# EAGLE board sboardnew (EAGLE 6.6.0)
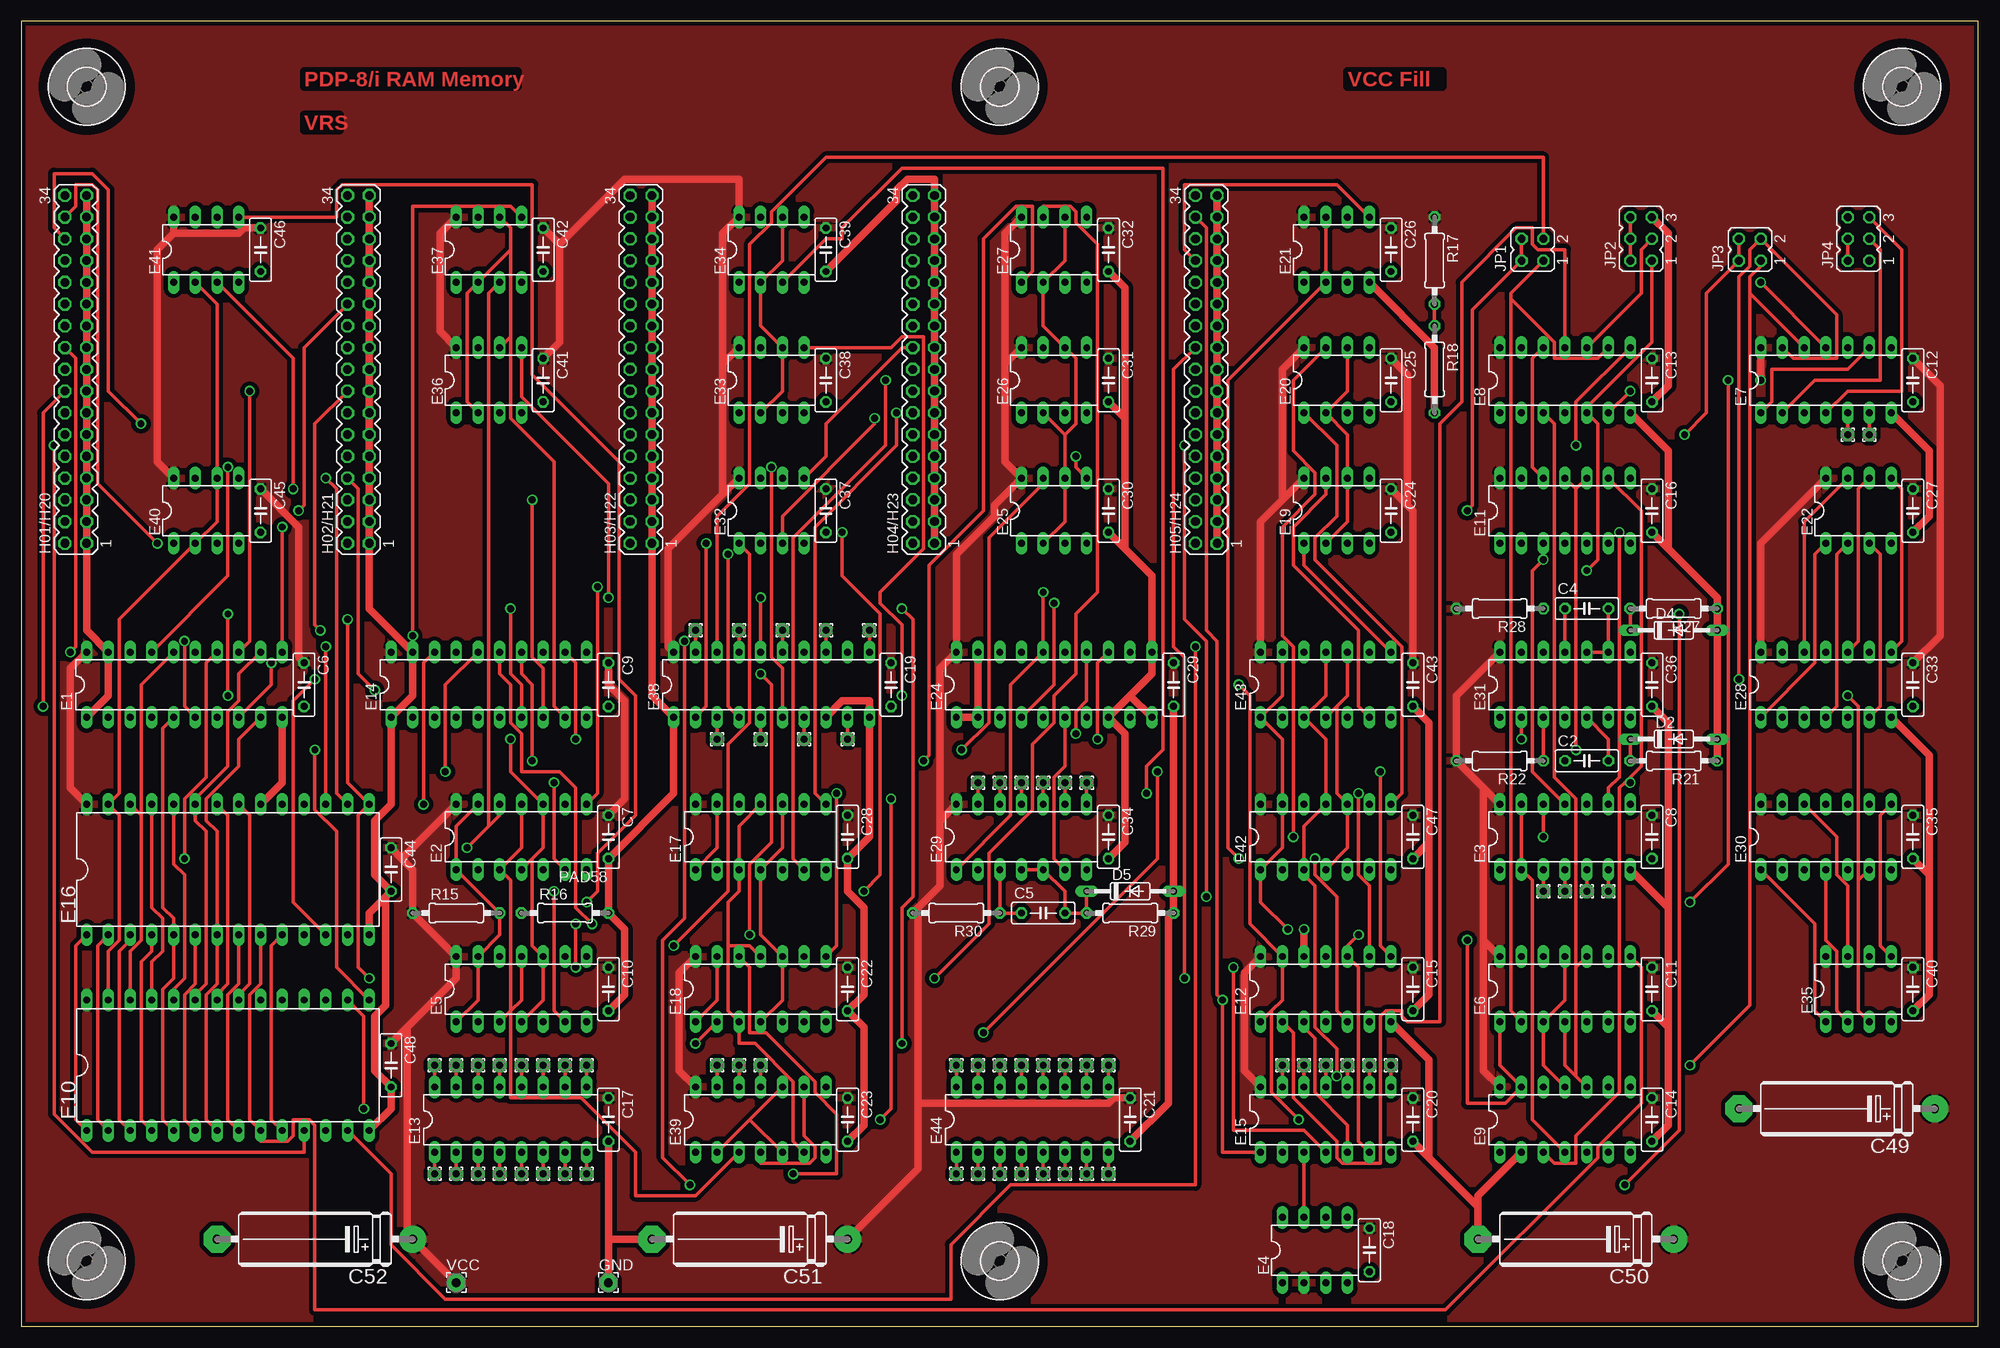
[diagram p5: board, top side]
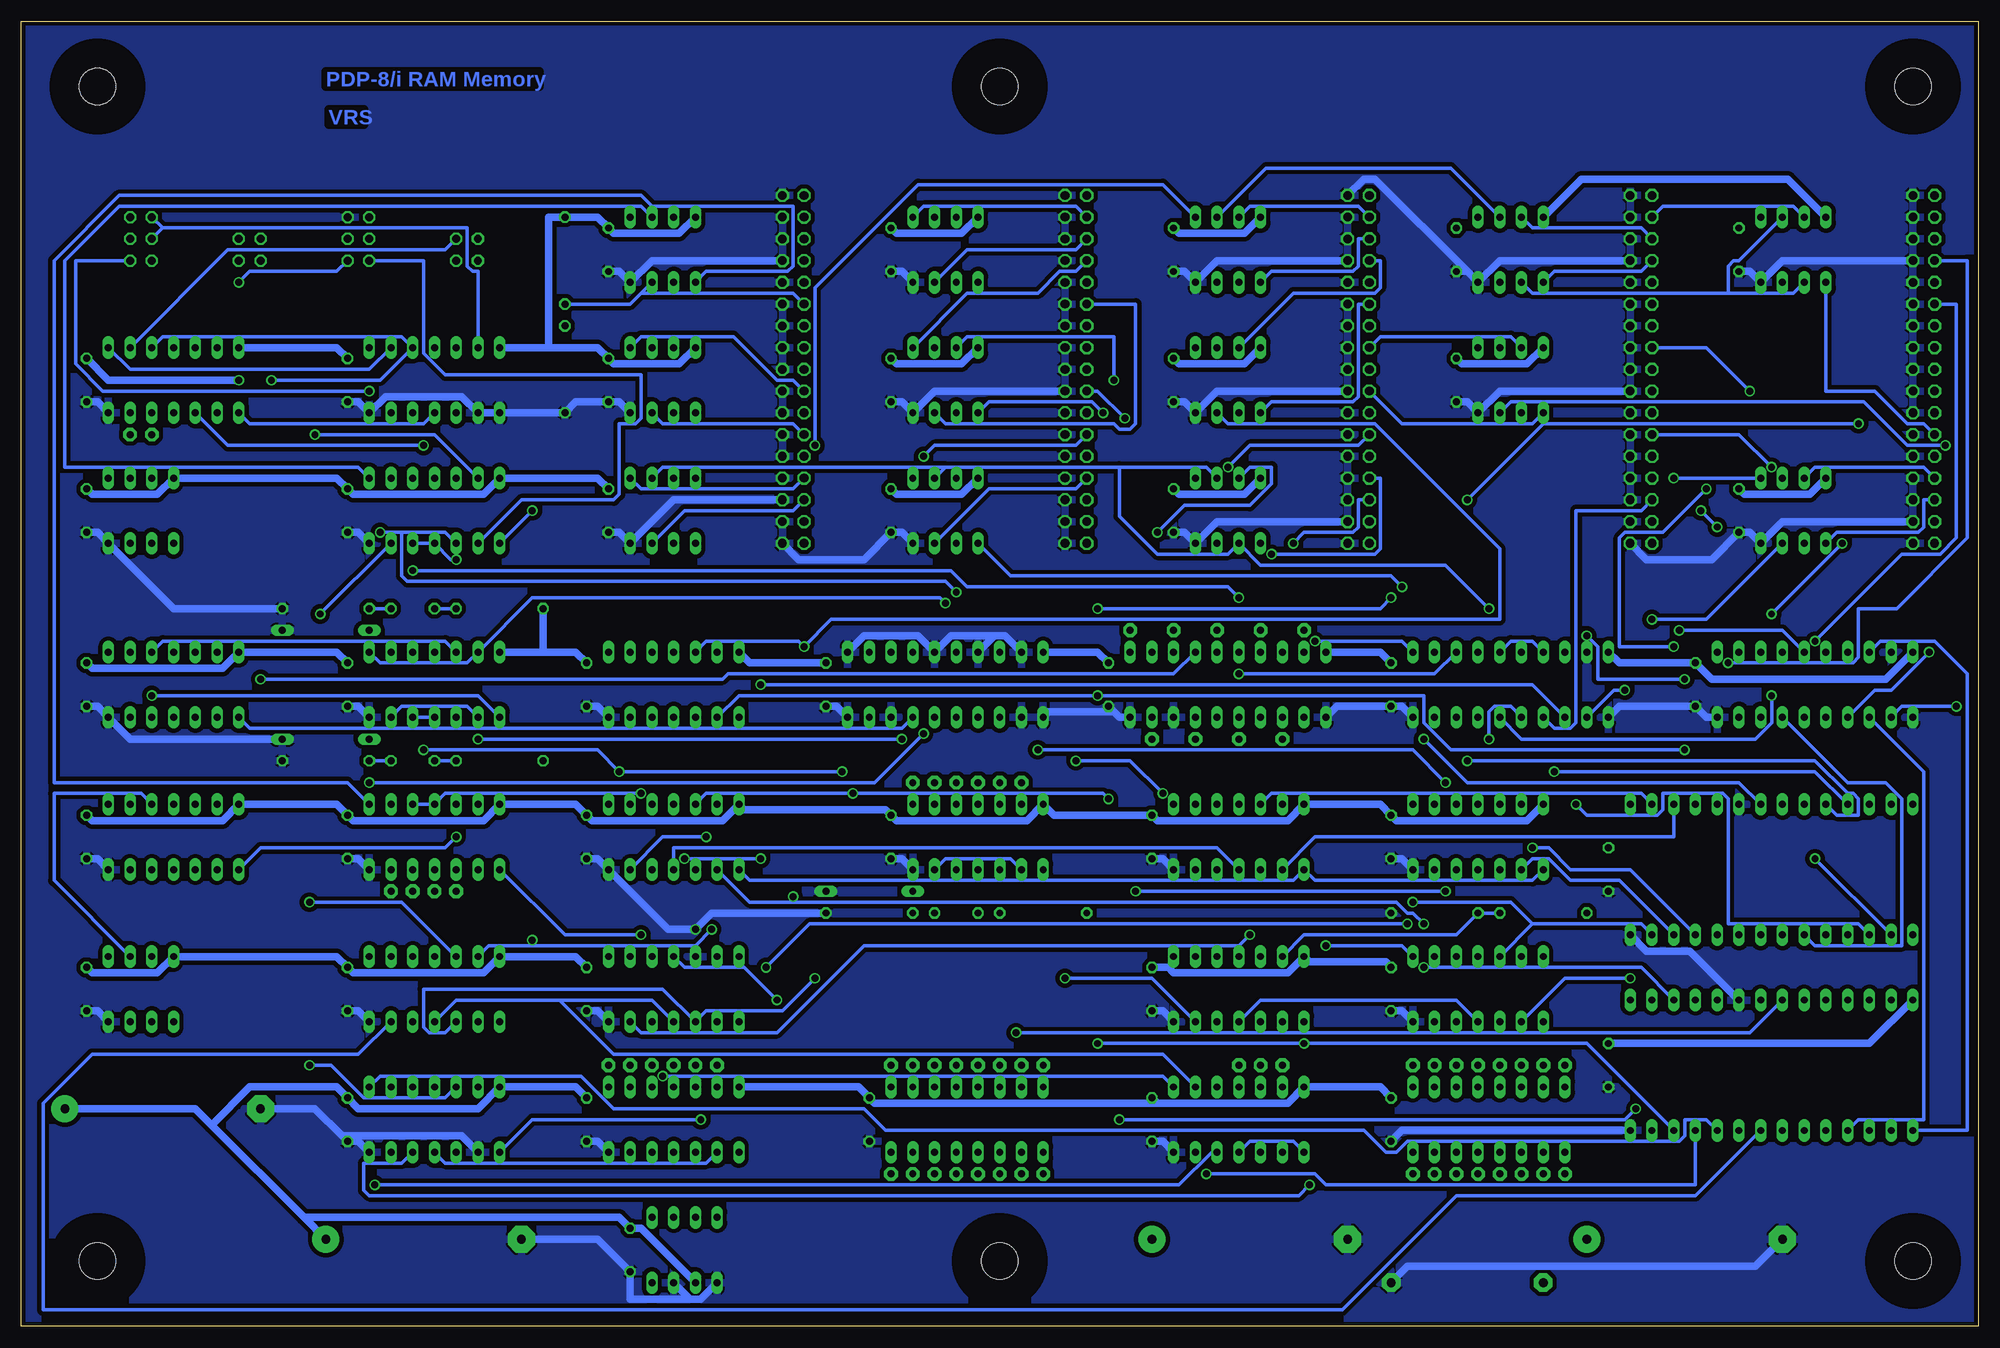
[diagram p6: board, bottom side, seen from below]

Size 228.6 x 152.4 mm. Coordinates in mm from the lower left corner, seen from the top.
Outline: 0,0 228.6,0 228.6,152.4 0,152.4 0,0
Copper layers (1+16): Top 0.035mm / dielectric 1.5mm / Bottom 0.035mm
Design rules "16mils": minimum track width 16mil, minimum drill 32mil, track to track 15mil, track to pad 10mil, pad to pad 10mil, via to via 10mil, smd to smd 10mil, copper to edge 13mil, drill to drill 10mil, minimum pad ring 10mil, minimum via ring 8mil, stop-mask expansion 0mil, vias tented up to drill 0mil, thermal gap 10mil
Net classes: 1 Power: width 0.889 mm

## Footprints (pad centres in the part's own frame; a part is rotated, then mirrored left to right if it is on the bottom)
C050-025X075 = drill 0.813 octagon: 1 -2.54,0; 2 2.54,0
E22-6 = drill 1.016 pad 3.15: + -11.43,0 | drill 1.016 pad 3.15 octagon: - 11.43,0
DO35-10 = drill 0.813 long: A 5.08,0; C -5.08,0
DIL20 = drill 0.813 long: 1 -11.43,-3.81; 2 -8.89,-3.81; 3 -6.35,-3.81; 4 -3.81,-3.81; 5 -1.27,-3.81; 6 1.27,-3.81; 7 3.81,-3.81; 8 6.35,-3.81; 9 8.89,-3.81; 10 11.43,-3.81; 11 11.43,3.81; 12 8.89,3.81; 13 6.35,3.81; 14 3.81,3.81; 15 1.27,3.81; 16 -1.27,3.81; 17 -3.81,3.81; 18 -6.35,3.81; 19 -8.89,3.81; 20 -11.43,3.81
DIL14 = drill 0.813 long: 1 -7.62,-3.81; 2 -5.08,-3.81; 3 -2.54,-3.81; 4 0,-3.81; 5 2.54,-3.81; 6 5.08,-3.81; 7 7.62,-3.81; 8 7.62,3.81; 9 5.08,3.81; 10 2.54,3.81; 11 0,3.81; 12 -2.54,3.81; 13 -5.08,3.81; 14 -7.62,3.81
DIL08 = drill 0.813 long: 1 -3.81,-3.81; 2 -1.27,-3.81; 3 1.27,-3.81; 4 3.81,-3.81; 5 3.81,3.81; 6 1.27,3.81; 7 -1.27,3.81; 8 -3.81,3.81
DIL28-6 = drill 0.813 long: 1 -16.51,-7.62; 2 -13.97,-7.62; 3 -11.43,-7.62; 4 -8.89,-7.62; 5 -6.35,-7.62; 6 -3.81,-7.62; 7 -1.27,-7.62; 8 1.27,-7.62; 9 3.81,-7.62; 10 6.35,-7.62; 11 8.89,-7.62; 12 11.43,-7.62; 13 13.97,-7.62; 14 16.51,-7.62; 15 16.51,7.62; 16 13.97,7.62; 17 11.43,7.62; 18 8.89,7.62; 19 6.35,7.62; 20 3.81,7.62; 21 1.27,7.62; 22 -1.27,7.62; 23 -3.81,7.62; 24 -6.35,7.62; 25 -8.89,7.62; 26 -11.43,7.62; 27 -13.97,7.62; 28 -16.51,7.62
DIL16 = drill 0.813 long: 1 -8.89,-3.81; 2 -6.35,-3.81; 3 -3.81,-3.81; 4 -1.27,-3.81; 5 1.27,-3.81; 6 3.81,-3.81; 7 6.35,-3.81; 8 8.89,-3.81; 9 8.89,3.81; 10 6.35,3.81; 11 3.81,3.81; 12 1.27,3.81; 13 -1.27,3.81; 14 -3.81,3.81; 15 -6.35,3.81; 16 -8.89,3.81
2,15/1,0 = drill 1.016 pad 2.159 octagon: 1 0,0
MA17-2 = drill 1.016 octagon: 1 -20.32,-1.27; 2 -20.32,1.27; 3 -17.78,-1.27; 4 -17.78,1.27; 5 -15.24,-1.27; 6 -15.24,1.27; 7 -12.7,-1.27; 8 -12.7,1.27; 9 -10.16,-1.27; 10 -10.16,1.27; 11 -7.62,-1.27; 12 -7.62,1.27; 13 -5.08,-1.27; 14 -5.08,1.27; 15 -2.54,-1.27; 16 -2.54,1.27; 17 0,-1.27; 18 0,1.27; 19 2.54,-1.27; 20 2.54,1.27; 21 5.08,-1.27; 22 5.08,1.27; 23 7.62,-1.27; 24 7.62,1.27; 25 10.16,-1.27; 26 10.16,1.27; 27 12.7,-1.27; 28 12.7,1.27; 29 15.24,-1.27; 30 15.24,1.27; 31 17.78,-1.27; 32 17.78,1.27; 33 20.32,-1.27; 34 20.32,1.27
JP2Q = drill 0.914 octagon: 1 -1.27,-1.27; 2 -1.27,1.27; 3 1.27,-1.27; 4 1.27,1.27
JP3Q = drill 0.914 octagon: 1 -2.54,-1.27; 2 -2.54,1.27; 3 0,-1.27; 4 0,1.27; 5 2.54,-1.27; 6 2.54,1.27
1,6/0,8 = drill 0.813 pad 1.6 octagon: 1 0,0
0207/10 = drill 0.813 octagon: 1 -5.08,0; 2 5.08,0
4,3 = hole 4.3: 0,0

## Placement (x,y rotation side)
C2  .22uf  [C050-025X075]  182.88,66.04 0 top
C4  .22uf  [C050-025X075]  182.88,83.82 0 top
C5  .22uf  [C050-025X075]  119.38,48.26 0 top
C6  .01uF  [C050-025X075]  33.02,74.93 270 top
C7  .01uF  [C050-025X075]  68.58,57.15 270 top
C8  .01uF  [C050-025X075]  190.5,57.15 270 top
C9  .01uF  [C050-025X075]  68.58,74.93 270 top
C10  .01uF  [C050-025X075]  68.58,39.37 270 top
C11  .01uF  [C050-025X075]  190.5,39.37 270 top
C12  .01uF  [C050-025X075]  220.98,110.49 270 top
C13  .01uF  [C050-025X075]  190.5,110.49 270 top
C14  .01uF  [C050-025X075]  190.5,24.13 270 top
C15  .01uF  [C050-025X075]  162.56,39.37 270 top
C16  .01uF  [C050-025X075]  190.5,95.25 270 top
C17  .01uF  [C050-025X075]  68.58,24.13 270 top
C18  .01uF  [C050-025X075]  157.48,8.89 270 top
C19  .01uF  [C050-025X075]  101.6,74.93 270 top
C20  .01uF  [C050-025X075]  162.56,24.13 270 top
C21  .01uF  [C050-025X075]  129.54,24.13 270 top
C22  .01uF  [C050-025X075]  96.52,39.37 270 top
C23  .01uF  [C050-025X075]  96.52,24.13 270 top
C24  .01uF  [C050-025X075]  160.02,95.25 270 top
C25  .01uF  [C050-025X075]  160.02,110.49 270 top
C26  .01uF  [C050-025X075]  160.02,125.73 270 top
C27  .01uF  [C050-025X075]  220.98,95.25 270 top
C28  .01uF  [C050-025X075]  96.52,57.15 270 top
C29  .01uF  [C050-025X075]  134.62,74.93 270 top
C30  .01uF  [C050-025X075]  127,95.25 270 top
C31  .01uF  [C050-025X075]  127,110.49 270 top
C32  .01uF  [C050-025X075]  127,125.73 270 top
C33  .01uF  [C050-025X075]  220.98,74.93 270 top
C34  .01uF  [C050-025X075]  127,57.15 270 top
C35  .01uF  [C050-025X075]  220.98,57.15 270 top
C36  .01uF  [C050-025X075]  190.5,74.93 270 top
C37  .01uF  [C050-025X075]  93.98,95.25 270 top
C38  .01uF  [C050-025X075]  93.98,110.49 270 top
C39  .01uF  [C050-025X075]  93.98,125.73 270 top
C40  .01uF  [C050-025X075]  220.98,39.37 270 top
C41  .01uF  [C050-025X075]  60.96,110.49 270 top
C42  .01uF  [C050-025X075]  60.96,125.73 270 top
C43  .01uF  [C050-025X075]  162.56,74.93 270 top
C44  .01uF  [C050-025X075]  43.18,53.34 270 top
C45  .01uF  [C050-025X075]  27.94,95.25 270 top
C46  .01uF  [C050-025X075]  27.94,125.73 270 top
C47  .01uF  [C050-025X075]  162.56,57.15 270 top
C48  .01uF  [C050-025X075]  43.18,30.48 270 top
C49  6.8uF  [E22-6]  212.09,25.4 180 top
C50  6.8uF  [E22-6]  181.61,10.16 180 top
C51  6.8uF  [E22-6]  85.09,10.16 180 top
C52  6.8uF  [E22-6]  34.29,10.16 180 top
D2  1N4148  [DO35-10]  193.04,68.58 0 top
D4  1N4148  [DO35-10]  193.04,81.28 0 top
D5  1N4148  [DO35-10]  129.54,50.8 0 top
E1  74S240N  [DIL20]  19.05,74.93 0 top
E2  74S74N  [DIL14]  58.42,57.15 0 top
E3  7410N  [DIL14]  180.34,57.15 0 top
E4  MAX702CPA  [DIL08]  151.13,8.89 0 top
E5  74S74N  [DIL14]  58.42,39.37 0 top
E6  74S74N  [DIL14]  180.34,39.37 0 top
E7  7404N  [DIL14]  210.82,110.49 0 top
E8  7400N  [DIL14]  180.34,110.49 0 top
E9  74S74N  [DIL14]  180.34,24.13 0 top
E10  62256P  [DIL28-6]  24.13,30.48 0 top
E11  7410N  [DIL14]  180.34,95.25 0 top
E12  74S74N  [DIL14]  152.4,39.37 0 top
E13  SPARE  [DIL16]  57.15,24.13 0 top
E14  74S240N  [DIL20]  54.61,74.93 0 top
E15  7404N  [DIL14]  152.4,24.13 0 top
E16  62256P  [DIL28-6]  24.13,53.34 0 top
E17  74S74N  [DIL14]  86.36,57.15 0 top
E18  74S74N  [DIL14]  86.36,39.37 0 top
E19  DS75453N  [DIL08]  153.67,95.25 0 top
E20  DS75453N  [DIL08]  153.67,110.49 0 top
E21  DS75453N  [DIL08]  153.67,125.73 0 top
E22  DS1100M-250  [DIL08]  214.63,95.25 0 top
E24  74S240N  [DIL20]  120.65,74.93 0 top
E25  DS75453N  [DIL08]  120.65,95.25 0 top
E26  DS75453N  [DIL08]  120.65,110.49 0 top
E27  DS75453N  [DIL08]  120.65,125.73 0 top
E28  DS1005-250  [DIL14]  210.82,74.93 0 top
E29  7400N  [DIL14]  116.84,57.15 0 top
E30  DS1005-250  [DIL14]  210.82,57.15 0 top
E31  7400N  [DIL14]  180.34,74.93 0 top
E32  DS75453N  [DIL08]  87.63,95.25 0 top
E33  DS75453N  [DIL08]  87.63,110.49 0 top
E34  DS75453N  [DIL08]  87.63,125.73 0 top
E35  DS1100M-250  [DIL08]  214.63,39.37 0 top
E36  DS75453N  [DIL08]  54.61,110.49 0 top
E37  DS75453N  [DIL08]  54.61,125.73 0 top
E38  74S240N  [DIL20]  87.63,74.93 0 top
E39  7400N  [DIL14]  86.36,24.13 0 top
E40  DS75453N  [DIL08]  21.59,95.25 0 top
E41  DS75453N  [DIL08]  21.59,125.73 0 top
E42  74S74N  [DIL14]  152.4,57.15 0 top
E43  74S74N  [DIL14]  152.4,74.93 0 top
E44  SPARE  [DIL16]  118.11,24.13 0 top
GND  [2,15/1,0]  68.58,5.08 0 top
H01/H20  [MA17-2]  6.35,111.76 90 top
H02/H21  [MA17-2]  39.37,111.76 90 top
H03/H22  [MA17-2]  72.39,111.76 90 top
H04/H23  [MA17-2]  105.41,111.76 90 top
H05/H24  [MA17-2]  138.43,111.76 90 top
JP1  [JP2Q]  176.53,125.73 90 top
JP2  [JP3Q]  189.23,127 90 top
JP3  [JP2Q]  201.93,125.73 90 top
JP4  [JP3Q]  214.63,127 90 top
PAD1  [1,6/0,8]  213.36,104.14 0 top
PAD2  [1,6/0,8]  215.9,104.14 0 top
PAD3  [1,6/0,8]  157.48,30.48 0 top
PAD4  [1,6/0,8]  160.02,30.48 0 top
PAD5  [1,6/0,8]  99.06,81.28 270 top
PAD6  [1,6/0,8]  93.98,81.28 270 top
PAD7  [1,6/0,8]  88.9,81.28 270 top
PAD8  [1,6/0,8]  83.82,81.28 270 top
PAD9  [1,6/0,8]  78.74,81.28 270 top
PAD10  [1,6/0,8]  96.52,68.58 270 top
PAD11  [1,6/0,8]  91.44,68.58 270 top
PAD12  [1,6/0,8]  152.4,30.48 90 top
PAD13  [1,6/0,8]  154.94,30.48 90 top
PAD14  [1,6/0,8]  147.32,30.48 90 top
PAD15  [1,6/0,8]  149.86,30.48 90 top
PAD16  [1,6/0,8]  86.36,68.58 270 top
PAD17  [1,6/0,8]  81.28,68.58 270 top
PAD18  [1,6/0,8]  109.22,17.78 90 top
PAD19  [1,6/0,8]  111.76,17.78 90 top
PAD20  [1,6/0,8]  114.3,17.78 90 top
PAD21  [1,6/0,8]  116.84,17.78 90 top
PAD22  [1,6/0,8]  119.38,17.78 90 top
PAD23  [1,6/0,8]  121.92,17.78 90 top
PAD24  [1,6/0,8]  124.46,17.78 90 top
PAD25  [1,6/0,8]  127,17.78 90 top
PAD26  [1,6/0,8]  109.22,30.48 90 top
PAD27  [1,6/0,8]  177.8,50.8 270 top
PAD28  [1,6/0,8]  180.34,50.8 270 top
PAD29  [1,6/0,8]  182.88,50.8 270 top
PAD30  [1,6/0,8]  185.42,50.8 270 top
PAD31  [1,6/0,8]  121.92,63.5 90 top
PAD32  [1,6/0,8]  119.38,63.5 90 top
PAD33  [1,6/0,8]  124.46,63.5 90 top
PAD34  [1,6/0,8]  114.3,63.5 90 top
PAD35  [1,6/0,8]  111.76,63.5 90 top
PAD36  [1,6/0,8]  116.84,63.5 90 top
PAD37  [1,6/0,8]  111.76,30.48 90 top
PAD38  [1,6/0,8]  114.3,30.48 90 top
PAD39  [1,6/0,8]  116.84,30.48 90 top
PAD40  [1,6/0,8]  119.38,30.48 90 top
PAD41  [1,6/0,8]  121.92,30.48 90 top
PAD42  [1,6/0,8]  83.82,30.48 90 top
PAD43  [1,6/0,8]  81.28,30.48 90 top
PAD44  [1,6/0,8]  86.36,30.48 90 top
PAD45  [1,6/0,8]  124.46,30.48 90 top
PAD46  [1,6/0,8]  127,30.48 90 top
PAD47  [1,6/0,8]  48.26,17.78 0 top
PAD48  [1,6/0,8]  50.8,17.78 0 top
PAD49  [1,6/0,8]  53.34,17.78 0 top
PAD50  [1,6/0,8]  55.88,17.78 0 top
PAD51  [1,6/0,8]  58.42,17.78 0 top
PAD52  [1,6/0,8]  60.96,17.78 0 top
PAD53  [1,6/0,8]  63.5,17.78 0 top
PAD54  [1,6/0,8]  66.04,17.78 0 top
PAD55  [1,6/0,8]  48.26,30.48 0 top
PAD56  [1,6/0,8]  50.8,30.48 0 top
PAD57  [1,6/0,8]  53.34,30.48 0 top
PAD58  [1,6/0,8]  55.88,30.48 0 top
PAD59  [1,6/0,8]  58.42,30.48 0 top
PAD60  [1,6/0,8]  60.96,30.48 0 top
PAD61  [1,6/0,8]  63.5,30.48 0 top
PAD62  [1,6/0,8]  66.04,30.48 0 top
R15  330  [0207/10]  50.8,48.26 0 top
R16  750  [0207/10]  63.5,48.26 0 top
R17  330  [0207/10]  165.1,124.46 270 top
R18  750  [0207/10]  165.1,111.76 270 top
R21  330  [0207/10]  193.04,66.04 180 top
R22  330  [0207/10]  172.72,66.04 180 top
R27  330  [0207/10]  193.04,83.82 180 top
R28  330  [0207/10]  172.72,83.82 180 top
R29  330  [0207/10]  129.54,48.26 180 top
R30  330  [0207/10]  109.22,48.26 180 top
U$20  [4,3]  219.71,144.78 270 top
U$66  [4,3]  114.3,144.78 270 top
U$67  [4,3]  114.3,7.62 270 top
U$82  [4,3]  219.71,7.62 270 top
U$83  [4,3]  7.62,7.62 270 top
U$86  [4,3]  7.62,144.78 270 top
VCC  [2,15/1,0]  50.8,5.08 0 top

## Tracks (layer width: path | path; a pad name or v marks a point on that pad's centre or on a via)
B17S1
  Top 0.406: E39.9 91.44,22.23 92.71,20.95 92.71,19.68 92.08,19.05 86.36,19.05 E39.4 | 181.61,29.21 180.34,30.48 E6.4 | 181.61,29.21 E9.10 | 181.61,41.91 E6.10 | 181.61,29.21 181.61,41.91 | E8.3 179.07,105.41 179.07,64.14 181.61,61.59 181.61,41.91
  Bottom 0.406: E39.1 80.01,21.59 85.09,21.59 E39.4 | E12.4 154.94,38.1 165.74,38.1 | 165.74,38.1 177.8,38.1 E6.4 | E39.9 95.25,31.75 159.38,31.75 165.74,38.1
B17V1  (via drill 0.81)
  Top 0.406: E17.1 81.28,55.88 E17.13 | E18.1 81.28,38.1 E18.13 | E5.1 53.34,38.1 E5.13 55.88,45.72 R15.2 E2.1 50.8,58.42 E2.13 | E6.1 172.72,30.48 E9.13 173.35,26.04 168.91,26.04 v168.91,45.09 | E43.13 147.32,73.66 E43.1 147.32,68.58 E42.13 147.32,55.88 E42.1 144.78,49.53 v147.96,46.35
  Bottom 0.406: R15.2 R16.1 60.96,45.72 78.74,45.72 E18.13 | E2.1 52.07,52.07 77.47,52.07 E17.1 80.01,52.07 143.51,52.07 E42.1 | E6.13 173.99,44.45 168.91,44.45 | 168.91,44.45 149.86,44.45 v147.96,46.35 | 168.91,44.45 v168.91,45.09
D01BINIT  (via drill 0.81)
  Top 0.406: E15.4 149.86,22.86 141.6,22.86 v141.6,41.91 | v66.67,46.99 64.77,48.9 64.77,62.87 62.87,64.77 58.42,64.77 58.42,69.22 57.15,70.48 57.15,74.93 55.88,76.2 E14.15
  Bottom 0.406: E14.17 52.07,80.01 54.61,80.01 E14.15 | v141.6,41.91 136.53,46.99 v66.67,46.99
D01BTP2L
  Top 0.406: E3.13 E3.2 176.53,52.07 176.53,24.13 E9.4
  Bottom 0.406: E15.2 148.59,19.05 179.07,19.05 E9.4
D01DEL2X
  Top 0.406: E22.1 209.55,90.17 209.55,77.47 E28.1
  Bottom 0.406: E24.7 125.73,69.85 201.93,69.85 E28.1
D01DEL4  (via drill 0.81)
  Top 0.406: E29.1 115.57,59.69 115.57,74.93 E24.16 v119.38,85.72 | v186.69,92.71 186.69,64.14 185.42,62.87 E3.9
  Bottom 0.406: E11.3 179.07,92.71 184.15,92.71 | v186.69,92.71 184.15,92.71 | v119.38,85.72 120.65,87 183.51,87 184.15,87.63 184.15,92.71
D01DEL5  (via drill 0.81)
  Top 0.406: E9.3 179.07,19.05 181.61,19.05 181.61,22.23 186.69,27.3 186.69,62.87 187.32,63.5 | 187.32,63.5 189.23,65.41 189.23,95.25 E11.9 | E24.14 124.46,73.03 123.19,71.75 v123.19,69.22 | 187.32,63.5 v187.96,63.5
  Bottom 0.406: v123.19,69.22 128.91,63.5 v187.96,63.5
D01DONEL
  Bottom 0.406: E21.6 156.21,130.81 217.17,130.81 223.52,124.46 223.52,100.33 189.23,100.33 E11.8
D01INITL  (via drill 0.81)
  Top 0.406: v142.24,74.93 143.51,73.66 143.51,46.99 E12.13 147.32,38.1 146.05,36.83 | 146.05,36.83 E12.1 | v149.22,24.13 146.05,27.3 146.05,36.83
  Bottom 0.406: E14.3 52.07,74.93 v142.24,74.93 | E9.1 168.91,24.13 v149.22,24.13
D01LOADMDL  (via drill 0.81)
  Top 0.406: E39.10 85.09,24.13 | 85.09,24.13 E39.2 | 85.09,24.13 E39.5 | v193.68,83.19 193.68,22.86 v187.32,16.51
  Bottom 0.406: v193.68,83.19 E11.6 | v187.32,16.51 93.34,16.51 89.53,20.32 E39.5
D01MEMDONEL
  Top 0.406: E21.5 153.67,133.35 135.89,133.35 135.89,125.73 H05/H24.28
D01MEMSTARTL  (via drill 0.81)
  Top 0.406: E15.6 156.21,21.59 156.21,41.91 E12.10 154.94,44.45 v156.21,45.72
  Bottom 0.406: E3.1 165.1,45.72 v156.21,45.72
D01POWEROK
  Top 0.406: E15.3 E4.7
D01READH  (via drill 0.81)
  Top 0.406: E12.9 157.48,51.44 156.21,52.7 v156.21,62.23 | v177.8,89.53 176.53,88.27 176.53,64.77 E3.11
  Bottom 0.406: E11.5 E11.4 178.44,89.53 v177.8,89.53 | v156.21,62.23 179.07,62.23 E3.11 E3.10
D01READL  (via drill 0.81)
  Top 0.406: E10.22 22.86,38.73 24.13,40.01 24.13,59.69 E16.22 | E12.8 158.75,44.45 v158.75,64.77 | 181.61,97.79 v181.61,67.31 | E11.11 181.61,97.79 | 181.61,97.79 E11.10 | v112.39,34.29 132.72,54.61 v132.72,64.77
  Bottom 0.406: v181.61,67.31 161.29,67.31 v158.75,64.77 v132.72,64.77 | E10.22 26.67,34.29 v112.39,34.29
D01SELECTH  (via drill 0.81)
  Top 0.406: v86.36,76.2 87.63,74.93 87.63,56.52 85.09,53.98 v85.09,45.72
  Bottom 0.406: E14.13 63.5,76.2 v86.36,76.2 | v85.09,45.72 86.36,44.45 130.18,44.45 140.34,34.29 156.21,34.29 E12.6
D01SELECTL  (via drill 0.81)
  Top 0.406: E21.7 E21.2 140.97,110.49 140.97,55.88 v142.24,54.61 | E12.5 153.67,36.83 153.67,50.16 151.13,52.7 v151.13,54.61
  Bottom 0.406: v142.24,54.61 v151.13,54.61
D01SELL
  Top 0.406: E12.2 148.59,34.29 148.59,26.67 153.67,21.59 153.67,19.68 154.31,19.05 158.75,19.05 158.75,36.2 159.38,36.83 161.29,36.83 161.29,36.2 161.93,35.56 165.74,35.56 165.74,105.41 168.28,107.95 168.28,121.92 174.62,128.27 176.53,128.27 176.53,126.36 177.16,125.73 180.34,125.73 E8.11
D01STROBEL
  Top 0.406: R17.2 R18.1
  Bottom 0.406: 156.21,120.65 157.48,119.38 R17.2 | 156.21,120.65 E21.3 | H05/H24.24 138.43,120.65 156.21,120.65
D01WRITEH  (via drill 0.81)
  Top 0.406: v77.47,80.01 77.47,47.62 74.93,45.09 74.93,19.68 v78.11,16.51
  Bottom 0.406: E14.11 67.31,80.01 v77.47,80.01 | v78.11,16.51 79.38,15.24 187.96,15.24 188.59,15.88 188.59,19.05 184.15,19.05 E9.5
D01WRITEL
  Top 0.406: E33.2 88.9,109.22 E33.6 86.36,116.84 E34.2 88.9,124.46 E34.6 | E36.2 52.07,107.95 52.07,120.65 E37.2 57.15,125.73 | 57.15,115.57 E36.6 | 57.15,125.73 57.15,128.27 E37.6 | 57.15,125.73 57.15,115.57 | E14.9 62.23,72.39 62.23,100.97 57.15,106.05 57.15,115.57 | E10.27 10.16,43.81 11.43,45.09 11.43,59.69 E16.27 11.43,62.23 11.43,82.55 E40.2 22.86,93.98 E40.6 22.86,119.38 E41.2
  Bottom 0.406: E34.6 83.19,135.25 61.59,135.25 E37.6 | E41.6 27.94,124.46 28.57,124.46 29.21,123.83 29.21,120.65 | 29.21,120.65 21.59,120.65 E41.2 | E37.2 52.07,120.65 29.21,120.65
D02MEM0
  Bottom 0.406: E25.3 115.57,97.79 105.41,97.79 H04/H23.8
D02MEM1  (via drill 0.81)
  Top 0.406: E25.5 123.19,100.33 v123.19,101.6
  Bottom 0.406: v123.19,101.6 121.92,102.87 105.41,102.87 H04/H23.12
D02MEM2  (via drill 0.81)
  Top 0.406: E32.3 88.9,94.61 99.69,105.41 v99.69,106.05
  Bottom 0.406: v99.69,106.05 102.87,109.22 H04/H23.16
D02MEM3
  Top 0.406: E32.5 93.98,101.6 93.98,105.41 102.87,114.3 H04/H23.20
D02MEM4
  Bottom 0.406: E26.3 120.65,105.41 100.97,105.41 100.33,104.78 99.06,104.78 98.42,105.41 98.42,119.38 H04/H23.24
D02MEM5
  Bottom 0.406: E26.5 118.11,120.65 109.86,120.65 107.31,123.19 105.41,123.19 H04/H23.28
D02MEM6
  Bottom 0.406: E27.3 118.11,125.73 105.41,125.73 H04/H23.30
D02MEM7
  Bottom 0.406: E27.5 123.19,130.81 105.41,130.81 H04/H23.32
D02MEM8
  Bottom 0.406: E19.3 151.13,95.25 138.43,95.25 H05/H24.6
D02MEM9
  Bottom 0.406: E19.5 156.21,97.79 138.43,97.79 H05/H24.8
D02MEM10
  Bottom 0.406: E20.3 153.67,105.41 138.43,105.41 H05/H24.12
D02MEM11
  Bottom 0.406: E20.5 156.21,115.57 145.41,115.57 140.34,110.49 138.43,110.49 H05/H24.16
D03BEMA0L
  Top 0.406: E10.8 24.13,24.13 24.13,38.73 25.4,40.01 E16.8
  Bottom 0.406: E6.6 189.23,31.75 220.34,31.75 226.06,26.04 226.06,1.91 74.3,1.91 60.96,15.24 33.02,15.24 E10.8
D03BEMA1L
  Top 0.406: E16.9 27.94,40.01 26.67,38.73 26.67,24.13 E10.9 27.94,21.59 31.11,21.59 31.75,22.23 31.75,24.13 33.66,24.13 34.29,23.5 34.29,1.91 166.37,1.91 184.15,19.68 184.15,20.95 189.23,26.04 189.23,41.91 E6.8
D03BEMA2L
  Top 0.406: E10.10 29.21,24.13 29.21,44.45 E16.10
  Bottom 0.406: E9.8 186.69,29.21 163.19,29.21 159.38,25.4 130.18,25.4 127.64,22.86 71.75,22.86 69.22,20.32 67.94,20.32 66.67,21.59 34.92,21.59 34.29,22.23 34.29,24.13 31.75,24.13 E10.10
D03BMA0  (via drill 0.81)
  Top 0.406: v2.54,72.39 2.54,106.68 H01/H20.16
  Bottom 0.406: E1.2 8.89,72.39 v2.54,72.39
D03BMA1  (via drill 0.81)
  Top 0.406: v5.71,78.74 6.35,79.38 6.35,113.03 H01/H20.20
  Bottom 0.406: E1.4 12.06,74.3 10.16,74.3 v5.71,78.74
D03BMA2  (via drill 0.81)
  Top 0.406: E1.6 19.05,72.39 v19.05,80.01
  Bottom 0.406: v19.05,80.01 8.89,90.17 4.45,90.17 2.54,92.08 2.54,119.38 H01/H20.24
D03BMA3  (via drill 0.81)
  Top 0.406: E1.8 29.21,74.93 v29.21,77.47
  Bottom 0.406: v29.21,77.47 14.61,77.47 13.97,78.11 13.97,83.82 9.53,83.82 1.27,92.08 1.27,124.46 H01/H20.28
D03BMA4  (via drill 0.81)
  Top 0.406: E14.8 60.96,76.83 59.69,78.11 v59.69,96.52 | v13.97,105.41 10.16,109.22 10.16,132.72 8.26,134.62 3.81,134.62 3.81,128.27 H01/H20.30
  Bottom 0.406: v59.69,96.52 50.8,105.41 v13.97,105.41
D03BMA5  (via drill 0.81)
  Top 0.406: v24.13,83.19 v24.13,73.66 | v15.88,91.44 8.89,98.42 8.89,132.72 8.26,133.35 6.35,133.35 6.35,130.81 H01/H20.32
  Bottom 0.406: E14.6 53.34,68.58 26.04,68.58 24.13,70.48 v24.13,73.66 | v15.88,91.44 v24.13,83.19
D03BMA6
  Bottom 0.406: E14.4 49.53,69.85 47.62,69.85 46.99,70.48 46.99,95.25 39.37,95.25 H02/H21.6
D03BMA7  (via drill 0.81)
  Top 0.406: v41.27,74.3 39.37,76.2 39.37,97.79 H02/H21.8
  Bottom 0.406: E14.2 42.55,74.3 v41.27,74.3
D03BMA8  (via drill 0.81)
  Top 0.406: E1.17 24.13,87.63 v24.13,100.33
  Bottom 0.406: v24.13,100.33 27.94,104.14 H02/H21.12
D03BMA9  (via drill 0.81)
  Top 0.406: v34.92,81.28 34.29,81.92 34.29,105.41 H02/H21.16
  Bottom 0.406: E1.15 22.86,81.28 v34.92,81.28
D03BMA10  (via drill 0.81)
  Top 0.406: E1.13 26.67,80.01 v26.67,109.22
  Bottom 0.406: v26.67,109.22 31.75,114.3 H02/H21.20
D03BMA11  (via drill 0.81)
  Top 0.406: v30.48,93.34 E1.11 | v32.38,95.25 33.02,95.89 33.02,114.3 H02/H21.24
  Bottom 0.406: v32.38,95.25 v30.48,93.34
D03BTP2  (via drill 0.81)
  Top 0.406: E15.1 140.34,20.32 v140.34,38.1 139.7,38.73 139.7,80.01 138.43,81.28 138.43,128.27 H05/H24.32
  Bottom 0.406: v140.34,38.1 144.15,41.91 151.13,41.91 E12.11
D03EA0  (via drill 0.81)
  Top 0.406: E38.2 80.01,72.39 v80.01,91.44
  Bottom 0.406: v80.01,91.44 78.74,92.71 73.03,92.71 72.39,93.34 72.39,96.52 H03/H22.6
D03EA1  (via drill 0.81)
  Top 0.406: E38.4 82.55,72.39 v82.55,90.17
  Bottom 0.406: v82.55,90.17 70.48,90.17 69.85,90.81 69.85,99.06 H03/H22.8
D03EA2  (via drill 0.81)
  Top 0.406: E38.6 88.9,76.83 87.63,78.11 v87.63,100.33
  Bottom 0.406: v87.63,100.33 85.09,102.87 72.39,102.87 H03/H22.12
D03EMA0H
  Top 0.406: E6.2 173.99,36.83 173.99,120.02 | 173.99,120.02 173.99,120.65 JP1.1 | E8.9 184.15,113.03 179.07,113.03 179.07,114.94 173.99,120.02
  Bottom 0.406: E7.8 215.9,111.76 187.96,111.76 E8.9
D03EMA0L
  Top 0.406: E7.9 213.36,111.76 204.47,111.76 204.47,107.95 E7.1 | E38.18 81.28,94.61 85.09,98.42 85.09,126.36 87.63,128.91 87.63,130.18 93.98,136.53 177.8,136.53 JP1.3
  Bottom 0.406: E8.4 181.61,105.41 201.93,105.41 E7.1 | E7.9 204.47,125.73 179.07,125.73 JP1.3
D03EMA1H  (via drill 0.81)
  Top 0.406: v194.94,49.53 199.39,53.98 v199.39,110.49 | JP2.3 189.23,125.73 189.23,120.65 E8.10
  Bottom 0.406: E6.12 184.15,49.53 v194.94,49.53 | v199.39,110.49 186.69,110.49 E8.10 184.15,115.57 212.09,115.57 E7.10
D03EMA1L  (via drill 0.81)
  Top 0.406: v203.2,121.92 E7.11 | v86.36,85.09 E38.16 | v182.88,88.27 184.15,89.53 184.15,105.41 E8.5 182.88,107.31 190.5,114.94 JP2.1
  Bottom 0.406: v203.2,121.92 201.93,123.19 191.77,123.19 JP2.1 | v86.36,85.09 87.63,86.36 118.11,86.36 120.02,88.27 v182.88,88.27
D03EMA2H  (via drill 0.81)
  Top 0.406: v194.94,30.48 201.93,37.47 201.93,120.65 | 201.93,120.65 201.93,122.56 203.2,123.83 JP3.1 | 201.93,120.65 E7.12
  Bottom 0.406: E9.12 179.07,26.67 188.59,26.67 192.41,30.48 v194.94,30.48
D03EMA2L  (via drill 0.81)
  Top 0.406: v200.66,75.56 200.66,122.56 201.93,123.83 201.93,125.73 JP3.3 212.09,118.11 212.09,113.03 207.01,113.03 E7.13
  Bottom 0.406: E38.14 93.98,76.2 146.05,76.2 146.69,75.56 v200.66,75.56
D03MA0L
  Top 0.406: E10.1 6.35,24.13 6.35,44.45 E16.1
  Bottom 0.406: E1.18 11.43,80.01 5.08,80.01 1.27,76.2 1.27,22.86 E10.1
D03MA1L
  Top 0.406: E10.26 12.7,43.81 13.97,45.09 13.97,59.69 | E16.26 13.97,59.69 | E1.16 13.97,74.93 13.97,59.69
D03MA2L  (via drill 0.81)
  Top 0.406: E10.2 8.89,24.13 8.89,44.45 E16.2 | E1.14 21.59,77.47 21.59,64.14 19.05,61.59 v19.05,54.61
  Bottom 0.406: E16.2 v19.05,54.61
D03MA3L
  Top 0.406: E10.23 20.32,38.73 21.59,40.01 21.59,57.78 20.32,59.05 E16.23 20.32,61.59 24.13,65.41 24.13,71.75 25.4,73.03 25.4,76.2 E1.12
D03MA4L  (via drill 0.81)
  Top 0.406: E10.21 25.4,38.73 26.67,40.01 26.67,59.69 E16.21 | E14.12 64.77,77.47 v64.77,68.58
  Bottom 0.406: v64.77,68.58 59.69,63.5 27.94,63.5 E16.21
D03MA5L  (via drill 0.81)
  Top 0.406: E10.24 17.78,39.37 19.05,40.64 19.05,52.7 17.78,53.98 E16.24 | E14.14 58.42,76.2 59.69,74.93 v59.69,66.04
  Bottom 0.406: v59.69,66.04 19.05,66.04 15.24,62.23 14.61,62.23 13.97,61.59 13.97,59.69 16.51,59.69 E16.24
D03MA6L  (via drill 0.81)
  Top 0.406: E10.25 15.24,42.55 16.51,43.81 16.51,47.62 15.24,48.9 E16.25 | E14.16 49.53,74.93 v49.53,64.77
  Bottom 0.406: v49.53,64.77 19.05,64.77 E16.25
D03MA7L  (via drill 0.81)
  Top 0.406: E10.3 11.43,24.13 11.43,43.81 12.7,45.09 E16.3 | E14.18 46.99,77.47 v46.99,60.96
  Bottom 0.406: v46.99,60.96 45.72,59.69 37.47,59.69 36.83,60.33 36.83,62.23 29.84,62.23 29.21,61.59 29.21,46.99 13.97,46.99 E16.3
D03MA8L
  Top 0.406: E10.4 13.97,24.13 13.97,42.55 15.24,43.81 E16.4
  Bottom 0.406: E1.3 6.35,64.77 6.35,24.13 13.97,24.13 E10.4
D03MA9L
  Top 0.406: E10.5 16.51,24.13 16.51,39.37 17.78,40.64 E16.5 17.78,47.62 16.51,48.9 16.51,69.85 E1.5
D03MA10L
  Top 0.406: E10.6 19.05,24.13 19.05,38.73 20.32,40.01 E16.6
  Bottom 0.406: E1.7 15.24,63.5 10.79,63.5 8.89,61.59 8.89,44.45 19.05,44.45 E16.6
D03MA11L
  Top 0.406: E10.7 21.59,24.13 21.59,38.73 22.86,40.01 E16.7 22.86,57.78 21.59,59.05 21.59,61.59 25.4,65.41 25.4,68.58 E1.9
D03MCBMB0L
  Bottom 0.406: E37.1 49.53,123.19 39.37,123.19 H02/H21.28
D03MCBMB1L
  Bottom 0.406: E37.7 52.07,128.27 39.37,128.27 H02/H21.30
D03MCBMB2L
  Bottom 0.406: E41.7 21.59,130.81 36.83,130.81 H02/H21.32
D03MCBMB3L
  Bottom 0.406: E40.1 16.51,92.71 6.99,92.71 6.35,93.34 6.35,96.52 H01/H20.6
D03MCBMB4L
  Bottom 0.406: E40.7 19.05,100.33 6.35,100.33 H01/H20.8
D03MCBMB5L
  Bottom 0.406: E41.1 17.78,109.22 12.06,109.22 8.26,105.41 6.35,105.41 H01/H20.12
D03MCBMB6L
  Bottom 0.406: E36.1 52.07,105.41 67.31,105.41 H03/H22.16
D03MCBMB7L
  Bottom 0.406: E36.7 54.61,115.57 69.85,115.57 H03/H22.20
D03MCBMB8L
  Bottom 0.406: E33.1 82.55,107.95 73.03,107.95 72.39,108.58 72.39,119.38 H03/H22.24
D03MCBMB9L
  Bottom 0.406: E33.7 80.01,120.65 70.48,120.65 69.85,121.28 69.85,124.46 H03/H22.28
D03MCBMB10L
  Bottom 0.406: E34.1 82.55,123.19 73.03,123.19 72.39,123.83 72.39,127 H03/H22.30
D03MCBMB11L
  Bottom 0.406: E34.7 85.09,130.81 72.39,130.81 H03/H22.32
D03MEMSTART  (via drill 0.81)
  Top 0.406: E6.11 180.34,38.1 E6.3 177.8,30.48 E9.11 | E15.5 154.94,23.5 151.13,27.3 151.13,33.66 149.86,34.92 E12.3 | H05/H24.20 134.62,111.76 134.62,79.38 135.89,78.11 v135.89,40.64
  Bottom 0.406: v135.89,40.64 139.7,36.83 148.59,36.83 E12.3 153.67,39.37 181.61,39.37 181.61,34.92 180.97,34.29 179.07,34.29 E6.3
D04MD0L  (via drill 0.81)
  Top 0.406: 54.61,58.42 55.88,59.69 E2.12 | 54.61,58.42 v52.07,55.88 | E37.3 54.61,120.65 54.61,58.42
  Bottom 0.406: E16.11 40.64,53.34 47.62,53.34 50.16,55.88 v52.07,55.88
D04MD1L  (via drill 0.81)
  Top 0.406: E37.5 57.15,130.81 45.72,130.81 v45.72,80.64 | v34.29,75.56 31.75,73.03 31.75,49.53 E16.12
  Bottom 0.406: E16.12 41.91,52.07 47.62,52.07 50.16,54.61 52.07,54.61 E2.2 | v45.72,80.64 44.45,79.38 44.45,75.56 v34.29,75.56
D04MD2L  (via drill 0.81)
  Top 0.406: E41.5 36.83,129.54 36.83,132.72 37.47,133.35 59.69,133.35 59.69,111.12 69.85,100.97 69.85,75.56 71.75,73.66 71.75,59.69 67.31,55.24 67.31,50.8 v66.04,49.53
  Bottom 0.406: E16.13 39.37,46.99 52.07,46.99 | E5.12 52.07,46.99 | v66.04,49.53 54.61,49.53 52.07,46.99
D04MD3L  (via drill 0.81)
  Top 0.406: v40.64,40.64 39.37,41.91 39.37,59.69 E16.15 38.1,63.5 v38.1,82.55
  Bottom 0.406: E5.2 48.26,40.64 v40.64,40.64 | E40.3 31.75,82.55 v38.1,82.55
D04MD4L  (via drill 0.81)
  Top 0.406: v35.56,99.06 36.83,97.79 36.83,62.23 E16.16
  Bottom 0.406: E16.16 39.37,62.23 82.55,62.23 E17.12 | v35.56,99.06 E40.5
D04MD5L  (via drill 0.81)
  Top 0.406: E41.3 31.75,113.03 v31.75,97.79 | E16.17 v35.56,79.38
  Bottom 0.406: E16.17 35.56,57.15 77.47,57.15 E17.2 | v31.75,97.79 36.83,92.71 41.27,92.71 41.91,92.08 41.91,79.38 v35.56,79.38
D04MD6L  (via drill 0.81)
  Top 0.406: v90.17,17.78 95.25,17.78 95.25,24.77 92.71,27.3 92.71,28.57 87,34.29 85.09,34.29 85.09,41.91 E18.12 | v3.81,102.87 3.81,24.77 8.26,20.32 33.02,20.32 E10.11
  Bottom 0.406: E10.11 33.02,16.51 76.2,16.51 77.47,17.78 v90.17,17.78 | E36.3 54.61,107.95 13.34,107.95 8.26,102.87 v3.81,102.87
D04MD7L  (via drill 0.81)
  Top 0.406: E18.2 v78.74,33.02 | E36.5 58.42,108.58 68.58,98.42 v68.58,85.09 | v102.87,83.82 104.14,82.55 104.14,50.16 102.87,48.9 v102.87,33.02
  Bottom 0.406: E10.12 45.72,33.02 v78.74,33.02 v102.87,33.02 | v68.58,85.09 69.85,83.82 v102.87,83.82
D04MD8L  (via drill 0.81)
  Top 0.406: E10.13 43.18,17.78 43.18,9.53 49.53,3.17 108.58,3.17 108.58,9.53 115.57,16.51 137.16,16.51 v137.16,79.38
  Bottom 0.406: E43.12 148.59,80.01 137.79,80.01 v137.16,79.38 133.99,82.55 55.88,82.55 55.88,90.81 70.48,105.41 87.63,105.41 E33.3
D04MD9L  (via drill 0.81)
  Top 0.406: E10.15 36.83,41.91 36.83,57.78 34.29,60.33 v34.29,67.31 | E33.5 101.6,114.3 102.87,115.57 105.41,115.57 105.41,90.81 100.33,85.72 100.33,84.45 102.87,81.92 v102.87,73.66
  Bottom 0.406: v34.29,67.31 61.59,67.31 64.77,70.48 64.77,73.66 v102.87,73.66 144.78,73.66 E43.2
D04MD10L  (via drill 0.81)
  Top 0.406: E10.16 40.01,36.2 v40.01,25.4 | v100.33,24.13 101.6,25.4 v101.6,61.59 | E34.3 93.98,127 95.89,127 95.89,128.27 102.87,135.25 133.35,135.25 133.35,67.31 131.44,65.41 v131.44,62.23
  Bottom 0.406: v40.01,25.4 41.27,24.13 v100.33,24.13 | v101.6,61.59 102.23,62.23 v131.44,62.23 148.59,62.23 E42.12
D04MD11L  (via drill 0.81)
  Top 0.406: v64.77,46.99 v64.77,41.91 | v135.89,102.87 135.89,82.55 138.43,80.01 v138.43,50.16
  Bottom 0.406: E10.17 39.37,41.91 v64.77,41.91 | v64.77,46.99 66.04,48.26 66.67,48.26 67.94,49.53 138.43,49.53 | 138.43,49.53 143.51,49.53 E42.2 | E34.5 95.25,133.35 123.83,133.35 135.89,121.28 v135.89,102.87 | 138.43,49.53 v138.43,50.16
GND  (via drill 0.81)
  Top 0.889: C10.2 70.48,38.73 70.48,46.35 R16.2 C7.2 76.2,62.23 E38.1 73.66,73.66 H03/H22.1 H03/H22.3 H03/H22.5 H03/H22.7 H03/H22.9 H03/H22.11 H03/H22.13 H03/H22.15 H03/H22.17 H03/H22.19 H03/H22.21 H03/H22.23 H03/H22.25 H03/H22.27 H03/H22.29 H03/H22.31 H03/H22.33 | E1.1 10.16,73.66 E1.19 7.62,81.28 H01/H20.1 H01/H20.3 H01/H20.5 H01/H20.7 H01/H20.9 H01/H20.11 H01/H20.13 H01/H20.15 H01/H20.17 H01/H20.19 H01/H20.21 H01/H20.23 H01/H20.25 H01/H20.27 H01/H20.29 H01/H20.31 H01/H20.33 | GND.1 68.58,10.16 | 68.58,10.16 C17.2 | 68.58,10.16 C51.- | E10.14 43.18,25.4 C48.2 41.27,29.84 41.27,36.2 42.55,37.47 42.55,50.16 | 42.55,50.16 40.64,48.26 E16.14 | 42.55,50.16 C44.2 41.27,52.7 41.27,59.05 43.18,60.96 E14.1 45.72,73.66 E14.19 40.64,83.82 H02/H21.1 H02/H21.3 H02/H21.5 H02/H21.7 H02/H21.9 H02/H21.11 H02/H21.13 H02/H21.15 H02/H21.17 H02/H21.19 H02/H21.21 H02/H21.23 H02/H21.25 H02/H21.27 H02/H21.29 H02/H21.31 H02/H21.33 | E16.20 30.48,63.5 E1.10 | E21.4 165.1,114.3 R18.2 | H05/H24.33 H05/H24.31 H05/H24.29 H05/H24.27 H05/H24.25 H05/H24.23 H05/H24.21 H05/H24.19 H05/H24.17 H05/H24.15 H05/H24.13 H05/H24.11 H05/H24.9 H05/H24.7 H05/H24.5 H05/H24.3 H05/H24.1 | C40.2 222.88,38.73 222.88,52.7 | C35.2 222.88,52.7 | E28.7 222.88,66.67 222.88,52.7 | JP2.5 192.41,127.64 192.41,109.86 C13.2 | R21.1 D2.A D4.A R27.1 198.12,85.09 192.41,90.81 | 192.41,90.81 C16.2 | E7.7 222.88,102.23 222.88,94.61 C27.2 | E8.7 192.41,102.23 192.41,90.81 | E9.2 170.18,15.24 170.18,13.97 | C50.- 170.18,13.97 | 170.18,13.97 164.47,19.68 | 164.47,19.68 C20.2 | E12.7 164.47,31.11 164.47,19.68 | 192.41,34.92 C11.2
  Top 0.889: 192.41,34.92 192.41,23.5 C14.2 | 192.41,48.9 E3.7 | 192.41,34.92 192.41,48.9 | C36.2 192.41,70.48 192.41,48.9 | E24.1 E24.2 E24.19 | C23.2 98.42,23.5 98.42,34.92 C22.2 98.42,38.73 98.42,48.9 96.52,50.8 C28.2 99.06,57.15 E38.10 99.06,73.03 95.89,73.03 E38.8 | C21.2 133.99,26.04 133.99,47.62 R29.1 D5.A C29.2 | v149.86,46.35 E12.12 | C43.2 164.47,70.48 164.47,56.52 | C47.2 164.47,56.52 | H04/H23.1 H04/H23.3 H04/H23.5 H04/H23.7 H04/H23.9 H04/H23.11 H04/H23.13 H04/H23.15 H04/H23.17 H04/H23.19 H04/H23.21 H04/H23.23 H04/H23.25 H04/H23.27 H04/H23.29 H04/H23.31 H04/H23.33 106.68,133.99 103.5,133.99 102.23,132.72 102.23,131.44 C39.2 | 129.54,73.66 132.08,76.2 E24.11 132.08,87.63 128.91,90.81 | 129.54,73.66 E24.8 128.91,69.22 128.91,56.52 C34.2 | 128.91,90.81 C30.2 | 129.54,73.66 E24.10 | 128.91,106.05 C31.2 | 128.91,90.81 128.91,106.05 | C32.2 128.91,121.28 128.91,106.05 | C15.2 164.47,38.73 164.47,56.52
  Bottom 0.889: E5.7 67.31,36.83 C10.2 | E2.7 67.31,54.61 C7.2 | E14.10 67.31,72.39 C9.2 74.93,72.39 E38.1 | C39.2 92.71,123.19 E34.4 88.9,124.46 H03/H22.27 | C38.2 92.71,107.95 E33.4 88.9,109.22 H03/H22.15 | C37.2 92.71,92.71 E32.4 88.9,93.98 H03/H22.3 | C46.2 26.67,123.19 E41.4 22.86,124.46 H01/H20.27 | H01/H20.3 22.86,93.98 E40.4 26.67,92.71 C45.2 31.11,89.53 38.73,89.53 H02/H21.1 | C52.- 26.04,6.99 66.67,6.99 GND.1 | E10.20 33.66,43.81 38.73,43.81 E16.14 | E1.10 31.75,71.12 C6.2 41.91,72.39 E14.1 | 59.69,123.19 E37.4 55.88,124.46 H02/H21.27 | C42.2 59.69,123.19 | C41.2 59.69,107.95 E36.4 55.88,109.22 H02/H21.15 | C17.2 67.31,22.86 E10.14 | H03/H22.33 71.75,133.99 70.48,133.99 59.69,123.19 | C26.2 158.75,123.19 E21.4 154.94,124.46 H05/H24.27 | E20.4 158.75,107.95 C25.2 163.83,107.95 R18.2 E8.1 E8.2 177.16,108.58 186.06,108.58 E8.7 189.23,107.95 C13.2 | C24.2 158.75,92.71 E19.4 152.4,96.52 H05/H24.5 | C33.2 219.71,72.39 E28.7 215.9,68.58 D2.A | E35.4 219.71,36.83 C40.2 | E30.7 219.71,54.61 C35.2 | E7.7 219.71,107.95 C12.2 | C27.2 219.71,92.71 E22.4 210.82,83.82 R27.1 | E11.7 189.23,92.71 C16.2 | E4.1 149.22,3.17 150.5,3.17 | E4.3 150.5,3.17 | 150.5,3.17 157.48,3.17 C18.2 161.29,10.16 C50.- | E12.7 161.29,36.83 C15.2 | E15.7 161.29,21.59 C20.2 | E31.7 189.23,72.39 C36.2 | E3.7 189.23,54.61 C8.2 | E6.7 189.23,36.83 C11.2 | E9.7 189.23,21.59 C14.2 191.13,22.23 | 191.13,22.23 194.31,25.4 C49.- | E9.2 177.16,22.23 191.13,22.23 | 114.94,80.64 E24.17 | 114.94,80.64 113.67,80.64 E24.19 | 114.94,80.64 120.02,80.64 E24.15 123.83,80.64 130.18,80.64 E24.11 | E39.7 95.25,21.59 C23.2 | E18.7 95.25,36.83 C22.2 | E17.7 95.25,54.61 C28.2
  Bottom 0.889: 100.97,71.75 100.33,71.12 E38.10 | 100.97,71.75 C19.2 | E24.1 108.58,71.75 100.97,71.75 | E43.7 161.29,72.39 C43.2 | C47.2 161.29,54.61 E42.7 153.03,46.35 v149.86,46.35 147.96,48.26 R29.1 | E27.4 125.73,123.19 C32.2 | C31.2 125.73,107.95 E26.4 121.92,109.22 H04/H23.15 | E24.10 133.35,72.39 C29.2 | E25.4 125.73,92.71 C30.2 130.18,89.53 137.79,89.53 H05/H24.1 | E29.7 125.73,54.61 C34.2
  pour Bottom (isolate 0.508): 0,0 228.6,0 228.6,152.4 0,152.4
N$1
  Top 0.406: PAD1.1 E7.5
N$2
  Top 0.406: E28.4 212.09,72.39 212.09,90.17 E22.2
N$3
  Top 0.406: PAD2.1 E7.6
N$4
  Top 0.406: PAD3.1 E15.9
N$5
  Top 0.406: E29.4 E29.5 121.92,50.8 C5.2 R29.2 D5.C
N$6
  Top 0.406: PAD4.1 E15.8
N$7
  Top 0.406: JP4.4 JP4.2
  Bottom 0.406: E8.13 175.26,123.19 175.9,123.19 176.53,123.83 176.53,128.27 212.09,128.27 | JP4.6 212.09,128.27 | 212.09,128.27 JP4.4
N$8
  Top 0.406: E2.11 58.42,55.88 E2.3 57.15,52.07 57.15,36.83 | 57.15,36.83 58.42,38.1 E5.11 | 57.15,36.83 E5.3 | E39.3 78.74,15.24 71.75,15.24 71.75,20.32 65.41,26.67 57.15,26.67 57.15,36.83
N$9
  Top 0.406: R21.2 D2.C | E31.5 185.42,68.58 C2.2
  Bottom 0.406: E31.5 E31.4 | R21.2 C2.2
N$10
  Top 0.406: E35.7 213.36,51.44 212.09,52.7 212.09,57.15 E30.12
N$11
  Top 0.406: PAD5.1 E38.11
N$12  (via drill 0.81)
  Top 0.406: E5.6 62.23,36.83 v62.23,50.8 | v98.42,50.8 100.33,52.7 100.33,83.19 95.89,87.63 v95.89,92.71
  Bottom 0.406: v98.42,50.8 v62.23,50.8 | v95.89,92.71 92.71,95.89 85.09,95.89 82.55,98.42 82.55,100.33 85.09,100.33 E32.7
N$13
  Top 0.406: PAD6.1 E38.13
N$14  (via drill 0.81)
  Top 0.406: E2.8 67.31,62.23 v67.31,86.36
  Bottom 0.406: v67.31,86.36 68.58,87.63 113.03,87.63 E25.1
N$15  (via drill 0.81)
  Top 0.406: E2.6 62.23,54.61 v62.23,63.5 | v109.86,67.31 113.03,70.48 113.03,92.08 119.38,98.42 E25.7
  Bottom 0.406: v62.23,63.5 66.04,67.31 v109.86,67.31
N$16
  Top 0.406: 82.55,44.45 82.55,49.53 83.82,50.8 E17.3 83.82,58.42 E17.11 | 82.55,44.45 82.55,36.83 E18.3 83.82,33.02 85.72,33.02 90.17,28.57 90.17,21.59 E39.6 | E18.11 85.09,44.45 82.55,44.45
N$17  (via drill 0.81)
  Top 0.406: v76.2,44.45 82.55,50.8 82.55,67.94 85.09,70.48 85.09,90.17 E32.1
  Bottom 0.406: E5.8 67.31,44.45 v76.2,44.45
N$18
  Top 0.406: PAD7.1 E38.15
N$19
  Top 0.406: PAD9.1 E38.19
N$20
  Top 0.406: R22.1 E31.3
  Bottom 0.406: C2.1 R22.1
N$21  (via drill 0.81)
  Top 0.406: E42.4 154.94,55.88 E42.10 153.67,62.23 153.67,72.39 | 153.67,72.39 154.94,73.66 E43.10 | 153.67,72.39 E43.4 | E18.4 88.9,38.1 E18.10 86.36,45.72 E17.4 88.9,55.88 E17.10 | E5.4 60.96,38.1 E5.10 59.69,44.45 59.69,54.61 | 59.69,54.61 60.96,55.88 E2.10 57.15,64.77 v57.15,68.58 | 59.69,54.61 E2.4
  Bottom 0.406: E14.5 54.61,72.39 56.52,72.39 57.15,71.75 v57.15,68.58 | E18.4 83.82,38.1 60.96,38.1 E5.4 | E42.4 152.4,55.88 88.9,55.88 E17.4
N$22  (via drill 0.81)
  Top 0.406: E14.7 58.42,74.93 57.15,76.2 v57.15,83.82 | E19.2 154.94,93.98 E19.6 154.94,104.14 E20.2 154.94,109.22 E20.6 | E27.6 121.92,124.46 E27.2 119.38,116.84 E26.6 123.19,113.03 123.19,105.41 121.92,104.14 | E25.2 121.92,93.98 E25.6 121.92,104.14 | 121.92,104.14 E26.2
  Bottom 0.406: v57.15,83.82 62.23,88.9 83.82,88.9 E32.2 87.63,90.17 95.89,90.17 100.33,94.61 100.33,100.33 | E32.6 90.17,100.33 100.33,100.33 | 120.65,100.33 100.33,100.33 | E25.6 120.65,100.33 | E19.6 153.67,100.33 120.65,100.33
N$23  (via drill 0.81)
  Top 0.406: E24.13 125.73,77.47 v125.73,68.58 | E31.2 v175.26,68.58
  Bottom 0.406: E31.2 176.53,72.39 184.15,72.39 E31.6 | v175.26,68.58 v125.73,68.58
N$24  (via drill 0.81)
  Top 0.406: E17.6 90.17,54.61 90.17,92.08 100.97,102.87 v100.97,110.49
  Bottom 0.406: v100.97,110.49 100.97,115.57 118.11,115.57 E26.7
N$25  (via drill 0.81)
  Top 0.406: v106.68,40.64 113.03,46.99 113.03,55.24 118.11,60.33 118.11,67.94 120.65,70.48 120.65,73.66 123.19,76.2 123.19,83.19 125.73,85.72 125.73,126.36 123.19,128.91 123.19,130.18 122.56,130.81 119.38,130.81 E27.7
  Bottom 0.406: E18.6 96.52,40.64 v106.68,40.64
N$26  (via drill 0.81)
  Top 0.406: E18.8 95.25,44.45 v95.25,62.23 | v105.41,66.04 106.05,66.67 106.05,88.9 112.39,95.25 112.39,127 116.2,130.81 118.11,130.81 118.11,123.19 E27.1
  Bottom 0.406: v95.25,62.23 99.06,66.04 v105.41,66.04
N$27  (via drill 0.81)
  Top 0.406: E17.8 92.71,62.23 92.71,93.34 102.23,102.87 v102.23,106.68
  Bottom 0.406: v102.23,106.68 103.5,107.95 115.57,107.95 E26.1
N$28
  Top 0.406: PAD10.1 E38.9
N$29  (via drill 0.81)
  Top 0.406: E20.7 148.59,110.49 148.59,102.23 151.13,99.69 151.13,97.16 147.32,93.34 147.32,80.64 148.59,79.38 v148.59,57.15
  Bottom 0.406: v148.59,57.15 153.67,57.15 E42.6
N$30
  Top 0.406: E20.1 153.67,102.87 153.67,94.61 151.13,92.08 151.13,89.53 161.29,79.38 161.29,62.23 E42.8
N$31  (via drill 0.81)
  Top 0.406: E35.3 214.63,36.83 214.63,52.07 | E30.6 214.63,52.07 | v213.36,73.66 214.63,72.39 214.63,52.07
  Bottom 0.406: E31.1 175.26,73.66 v213.36,73.66
N$32
  Top 0.406: PAD11.1 E38.7
N$33
  Top 0.406: E31.10 E31.9 C4.2 | R27.2 D4.C
  Bottom 0.406: R27.2 C4.2
N$34
  Top 0.406: C4.1 E31.11
  Bottom 0.406: C4.1 R28.1
N$35  (via drill 0.81)
  Top 0.406: E30.1 209.55,46.99 209.55,36.83 E35.1 | v177.8,57.15 E3.12
  Bottom 0.406: v177.8,57.15 179.07,55.88 200.66,55.88 E30.1
N$36
  Top 0.406: PAD16.1 E38.5
N$37  (via drill 0.81)
  Top 0.406: E24.4 120.65,74.93 v120.65,84.45
  Bottom 0.406: v120.65,84.45 121.28,85.09 168.91,85.09 E31.13 176.53,77.47 186.69,77.47 E31.8
N$38
  Top 0.406: E22.6 214.63,97.79 214.63,80.01 E28.10
  Bottom 0.406: E31.12 179.07,80.01 212.09,80.01 E28.10
N$39
  Top 0.406: C5.1 R30.1 E29.3
N$40
  Top 0.406: E24.6 121.92,65.41 120.65,64.14 120.65,54.61 E29.6
  Bottom 0.406: E29.2 113.03,54.61 120.65,54.61 E29.6
N$41  (via drill 0.81)
  Top 0.406: E43.11 152.4,73.66 E43.3 152.4,68.58 E42.11 149.86,58.42 E42.3 149.86,52.7 151.13,51.44 151.13,34.92 153.67,32.38 v153.67,29.21
  Bottom 0.406: E39.8 95.25,29.21 v153.67,29.21
N$42
  Top 0.406: PAD17.1 E38.3
N$43
  Top 0.406: PAD8.1 E38.17
N$44
  Top 0.406: PAD18.1 E44.1
N$45
  Top 0.406: PAD19.1 E44.2
N$46
  Top 0.406: PAD20.1 E44.3
N$47
  Top 0.406: PAD21.1 E44.4
N$48
  Top 0.406: E28.12 208.28,93.98 E22.7
N$49
  Top 0.406: E28.6 217.17,72.39 217.17,90.17 E22.3
N$50
  Top 0.406: E28.8 219.71,80.01 219.71,97.79 E22.5
N$51
  Top 0.406: E30.4 210.82,45.09 212.09,43.81 212.09,36.83 E35.2
N$52
  Bottom 0.406: E35.6 224.79,52.07 224.79,62.23 214.63,62.23 E30.10
N$53
  Top 0.406: E35.5 217.17,44.45 217.17,59.69 E30.8
N$54
  Top 0.406: PAD12.1 E15.11
N$55
  Top 0.406: PAD13.1 E15.10
N$56
  Top 0.406: PAD14.1 E15.13
N$57
  Top 0.406: PAD15.1 E15.12
N$58
  Top 0.406: PAD22.1 E44.5
N$59
  Top 0.406: PAD23.1 E44.6
N$60
  Top 0.406: PAD24.1 E44.7
N$61
  Top 0.406: PAD25.1 E44.8
N$62
  Top 0.406: PAD26.1 E44.16
N$63
  Top 0.406: PAD37.1 E44.15
N$64
  Top 0.406: PAD38.1 E44.14
N$65
  Top 0.406: PAD39.1 E44.13
N$66
  Top 0.406: PAD40.1 E44.12
N$67
  Top 0.406: E43.6 156.21,72.39 156.21,81.28 148.59,88.9 148.59,93.34 152.4,97.16 E19.7
N$68
  Top 0.406: E43.8 149.86,88.9 E19.1
N$69
  Top 0.406: PAD41.1 E44.11
N$70
  Top 0.406: PAD45.1 E44.10
N$71
  Top 0.406: PAD27.1 E3.3
N$72
  Top 0.406: PAD28.1 E3.4
N$73  (via drill 0.81)
  Top 0.406: v187.96,109.22 E8.6
  Bottom 0.406: v187.96,109.22 219.07,109.22 222.25,112.39 222.25,124.46 JP4.1
N$74
  Top 0.406: PAD29.1 E3.5
N$75
  Top 0.406: PAD30.1 E3.6
N$76
  Top 0.406: PAD31.1 E29.9
N$77
  Top 0.406: PAD32.1 E29.10
N$78
  Top 0.406: PAD33.1 E29.8
N$79
  Top 0.406: PAD34.1 E29.12
N$80
  Top 0.406: PAD35.1 E29.13
N$81
  Top 0.406: PAD36.1 E29.11
N$82
  Top 0.406: PAD46.1 E44.9
N$83
  Top 0.406: PAD47.1 E13.1
N$84
  Top 0.406: PAD48.1 E13.2
N$85
  Top 0.406: PAD49.1 E13.3
N$86
  Top 0.406: PAD50.1 E13.4
N$87
  Top 0.406: PAD42.1 E39.12
N$88
  Top 0.406: PAD43.1 E39.13
N$89
  Top 0.406: PAD44.1 E39.11
N$90
  Top 0.406: PAD51.1 E13.5
N$91
  Top 0.406: PAD52.1 E13.6
N$92
  Top 0.406: PAD53.1 E13.7
N$93
  Top 0.406: PAD54.1 E13.8
N$94
  Bottom 0.406: E21.1 148.59,123.19 139.06,123.19 138.43,123.83 138.43,130.81 154.94,130.81 156.21,132.08 217.17,132.08 224.79,124.46 224.79,63.5 190.5,63.5 E3.8
N$95
  Top 0.406: PAD55.1 E13.16
N$96
  Top 0.406: PAD56.1 E13.15
N$97
  Top 0.406: PAD57.1 E13.14
N$98
  Top 0.406: PAD58.1 E13.13
N$99
  Top 0.406: PAD59.1 E13.12
N$100
  Top 0.406: PAD60.1 E13.11
N$101
  Top 0.406: PAD61.1 E13.10
N$102
  Top 0.406: PAD62.1 E13.9
N$103
  Top 0.406: E7.2 209.55,110.49 217.17,110.49 217.17,125.73 JP4.3
N$108  (via drill 0.81)
  Top 0.406: E8.8 181.61,107.95 v181.61,102.87
  Bottom 0.406: v181.61,102.87 204.47,102.87 E7.3
N$111
  Top 0.406: E7.4 213.36,109.22 219.71,109.22 219.71,125.73 JP4.5
N$113  (via drill 0.81)
  Top 0.406: v194.31,104.14 196.85,106.68 196.85,120.65 JP3.2 JP3.4
  Bottom 0.406: E11.13 180.34,104.14 v194.31,104.14
N$128
  Top 0.406: JP2.6 JP2.4 JP2.2
  Bottom 0.406: E11.2 170.18,96.52 159.38,96.52 158.75,97.16 158.75,105.41 156.84,105.41 156.21,106.05 156.21,111.12 179.07,111.12 181.61,113.67 181.61,124.46 JP2.2
N$129  (via drill 0.81)
  Top 0.406: v168.91,95.25 169.54,95.89 169.54,118.75 JP1.2 JP1.4
  Bottom 0.406: v168.91,95.25 E11.1
N$132
  Top 0.406: E11.12 176.53,100.33 176.53,113.03 E8.12
VCC  (via drill 0.81)
  Top 0.889: C12.1 224.16,109.86 224.16,80.64 C33.1 | v203.2,110.49 E7.14 | E22.8 203.2,91.44 E28.14 | 147.32,96.52 144.78,93.98 E43.14 | 147.32,96.52 E19.8 | E20.8 147.32,111.76 147.32,96.52 | 161.93,95.89 162.56,95.25 C43.1 | 161.93,95.89 C24.1 | E3.14 170.81,62.87 | 170.81,62.87 R22.2 167.64,73.66 E31.14 | 170.81,45.09 E6.14 | 170.81,62.87 170.81,45.09 | E9.14 170.81,29.84 170.81,45.09 | C25.1 161.93,111.12 161.93,95.89 | E16.28 5.71,62.87 5.71,76.83 E1.20 | C46.1 26.04,128.27 25.4,127.64 17.78,127.64 | E41.8 17.78,127.64 | C6.1 32.38,78.11 32.38,93.34 C45.1 | 17.78,127.64 15.88,125.73 15.88,100.97 E40.8 | VCC.1 C52.+ 45.09,10.79 45.09,34.92 | 45.09,34.92 50.8,40.64 E5.14 R15.1 45.72,53.34 44.45,54.61 | 45.09,34.92 C48.1 | 44.45,54.61 C44.1 | 44.45,54.61 E2.14 | 62.87,126.36 C42.1 | 62.87,126.36 62.87,114.94 C41.1 | E37.8 48.9,127.64 48.9,116.2 E36.8 | E38.20 75.56,79.38 75.56,90.81 81.92,97.16 | E32.8 81.92,97.16 | 81.92,112.39 E33.8 | 81.92,97.16 81.92,112.39 | 81.92,112.39 81.92,127.64 E34.8 83.82,133.99 70.48,133.99 62.87,126.36 | E12.14 142.88,41.27 142.88,29.84 E15.14 | E39.14 76.83,29.84 76.83,41.27 E18.14 | 114.94,112.39 114.94,100.97 E25.8 113.67,95.89 113.67,94.61 109.22,90.17 E24.20 107.31,76.83 107.31,59.05 | E26.8 114.94,112.39 | E27.8 114.94,127.64 114.94,112.39 | 104.78,48.9 107.31,51.44 107.31,59.05 | 104.78,48.9 R30.2 | E29.14 107.31,59.05 | C51.+ 104.78,18.41 104.78,26.04 | 104.78,48.9 104.78,26.04 | C21.1 127.64,26.67 127,26.04 104.78,26.04 | C9.1 68.58,74.93 70.48,73.03 70.48,61.59 C7.1
  Bottom 0.889: E4.2 156.21,11.43 C18.1 158.75,12.7 195.58,12.7 | 206.38,23.5 208.28,25.4 C49.+ | 206.38,23.5 195.58,12.7 | 195.58,12.7 C50.+ | C27.1 220.34,97.16 212.72,97.16 E22.8 191.77,99.06 C16.1 189.87,97.16 174.62,97.16 E11.14 161.29,99.06 C24.1 | C13.1 191.77,114.3 E7.14 | C36.1 191.77,78.74 E28.14 205.1,76.83 220.34,76.83 C33.1 | v203.2,110.49 218.44,110.49 C12.1 | C29.1 143.51,77.47 E43.14 | E8.14 167,114.3 | 167,114.3 161.29,114.3 C25.1 159.38,112.39 151.76,112.39 E20.8 | E21.8 151.76,127.64 159.38,127.64 C26.1 161.29,129.54 R17.1 167,129.54 167,114.3 | C43.1 163.83,78.74 167.64,78.74 | E31.14 167.64,78.74 | 167.64,78.74 R28.2 | C35.1 220.34,59.05 205.1,59.05 E30.14 191.77,60.96 C8.1 189.87,59.05 174.62,59.05 E3.14 163.83,60.96 C47.1 161.93,59.05 146.69,59.05 E42.14 144.15,60.33 127.64,60.33 C34.1 126.36,59.05 111.12,59.05 E29.14 107.95,59.69 C28.1 95.89,59.05 80.64,59.05 E17.14 69.85,60.96 C7.1 67.94,59.05 52.7,59.05 E2.14 | C40.1 220.34,41.27 212.72,41.27 E35.8 191.77,43.18 C11.1 189.87,41.27 174.62,41.27 E6.14 163.83,43.18 C15.1 | C20.1 163.83,27.94 E9.14 175.26,25.4 189.23,25.4 C14.1 191.77,27.94 201.93,27.94 206.38,23.5 | E14.20 41.91,77.47 C6.1 31.11,75.56 10.79,75.56 E1.20 | C45.1 27.3,97.16 19.68,97.16 E40.8 | E10.28 12.7,33.02 C48.1 | C41.1 60.33,112.39 52.7,112.39 E36.8 | C39.1 93.34,127.64 85.72,127.64 E34.8 | C38.1 93.34,112.39 85.72,112.39 E33.8 | C9.1 69.85,78.74 E38.20 | C37.1 93.34,97.16 85.72,97.16 E32.8 | E15.14 130.81,27.94 C21.1 128.91,26.04 95.89,26.04 | C17.1 69.85,27.94 E39.14 80.64,26.04 95.89,26.04 | 95.89,26.04 C23.1 | C10.1 69.22,42.55 78.11,42.55 E18.14 80.64,41.27 93.98,41.27 94.61,41.91 C22.1
  Bottom 0.889: C32.1 126.36,127.64 118.75,127.64 E27.8 | C30.1 126.36,97.16 118.75,97.16 E25.8 | C31.1 126.36,112.39 118.75,112.39 E26.8 | C19.1 102.87,78.74 E24.20 | E41.8 22.23,133.99 46.35,133.99 E37.8
  pour Top (isolate 0.508): 0,0 228.6,0 228.6,152.4 0,152.4

## Text on the board
Top: PDP-8/i RAM Memory | VCC Fill | VRS
Bottom: PDP-8/i RAM Memory | VRS